# Altium project ws22_companion-1_0_0.PrjPcb (part 1 of 4)
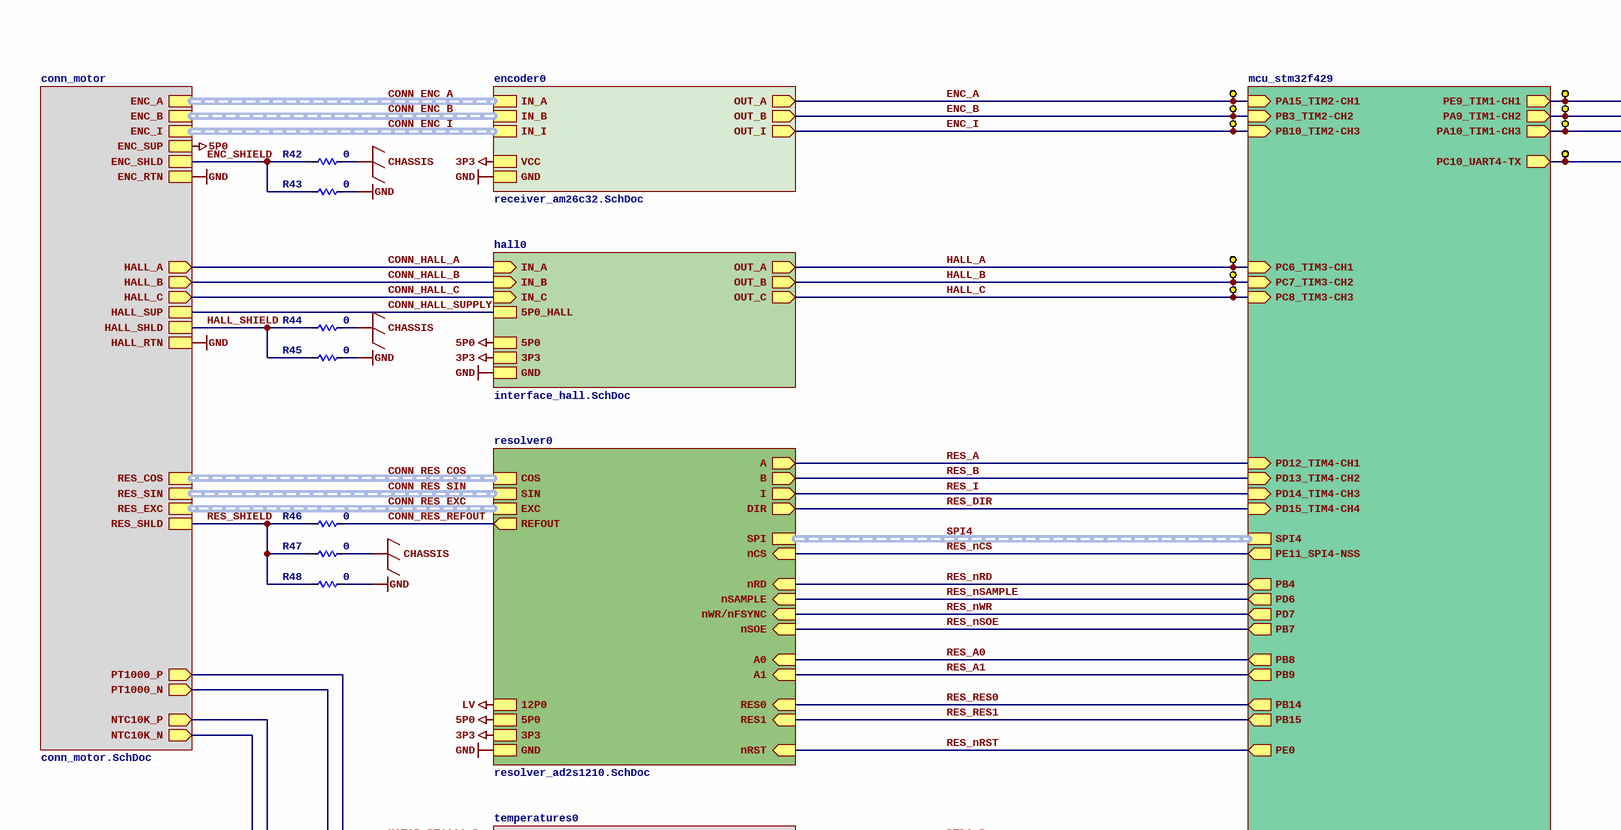
[diagram p0: top.SchDoc, top left]
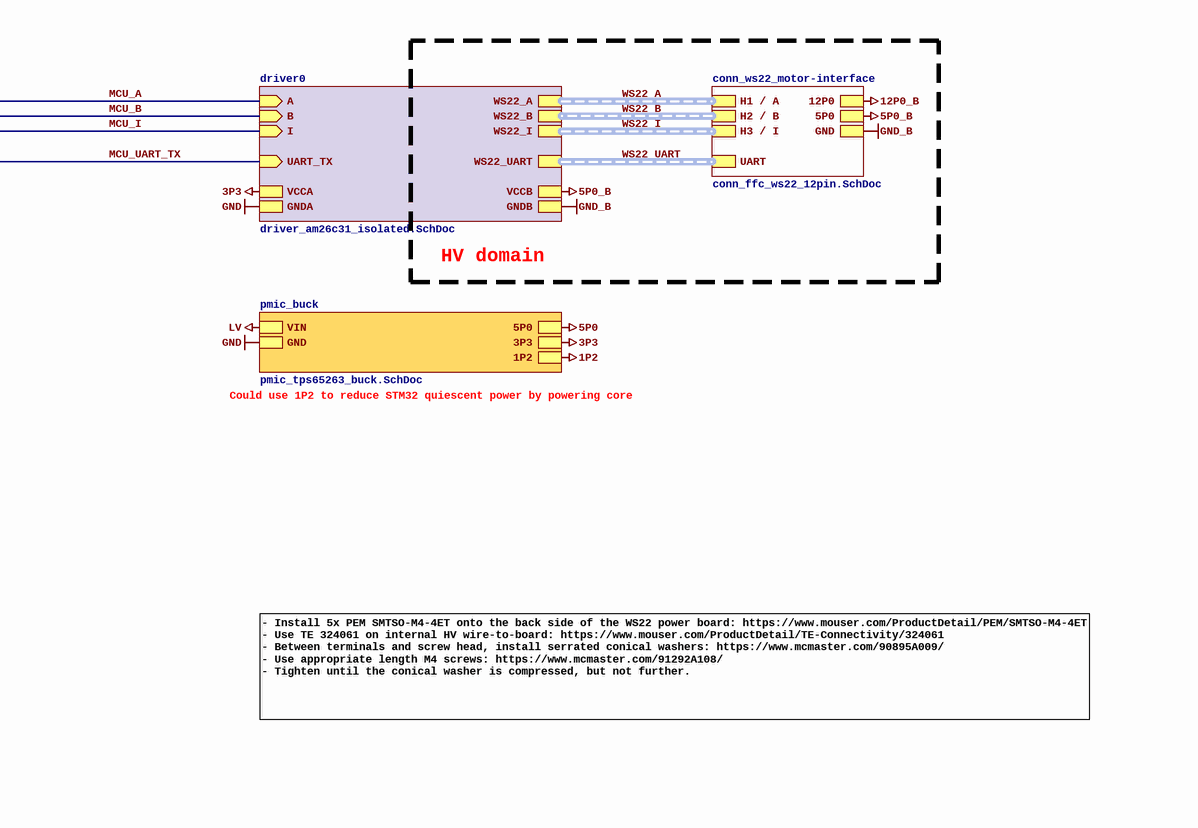
[diagram p1: top.SchDoc, top right]
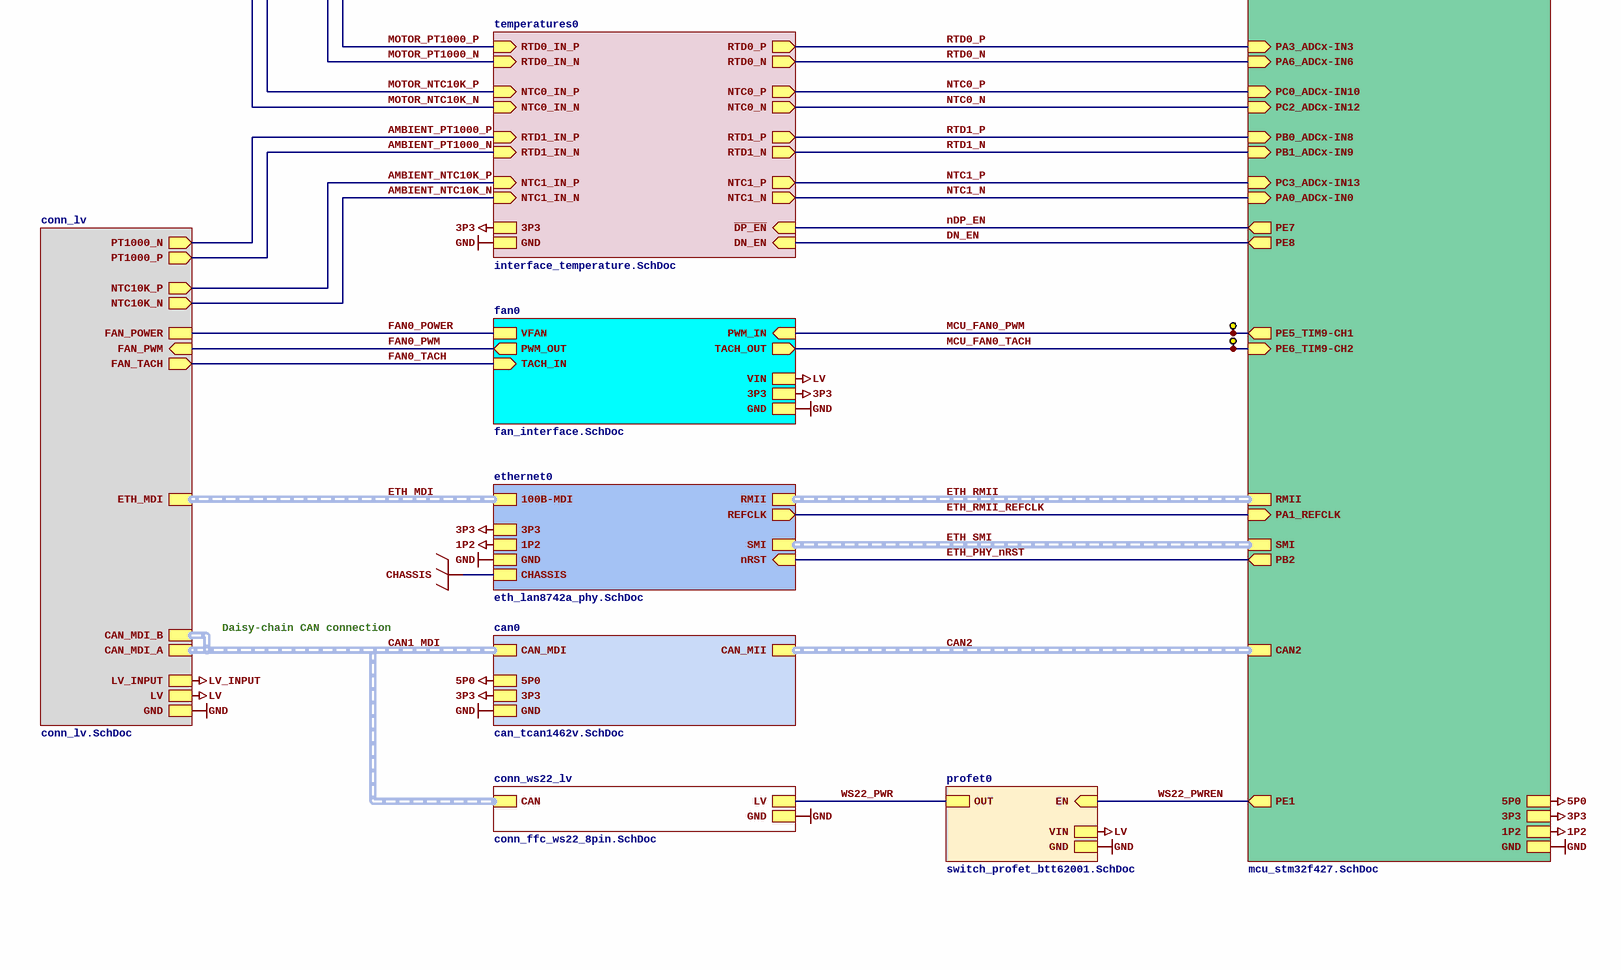
[diagram p2: top.SchDoc, bottom left]
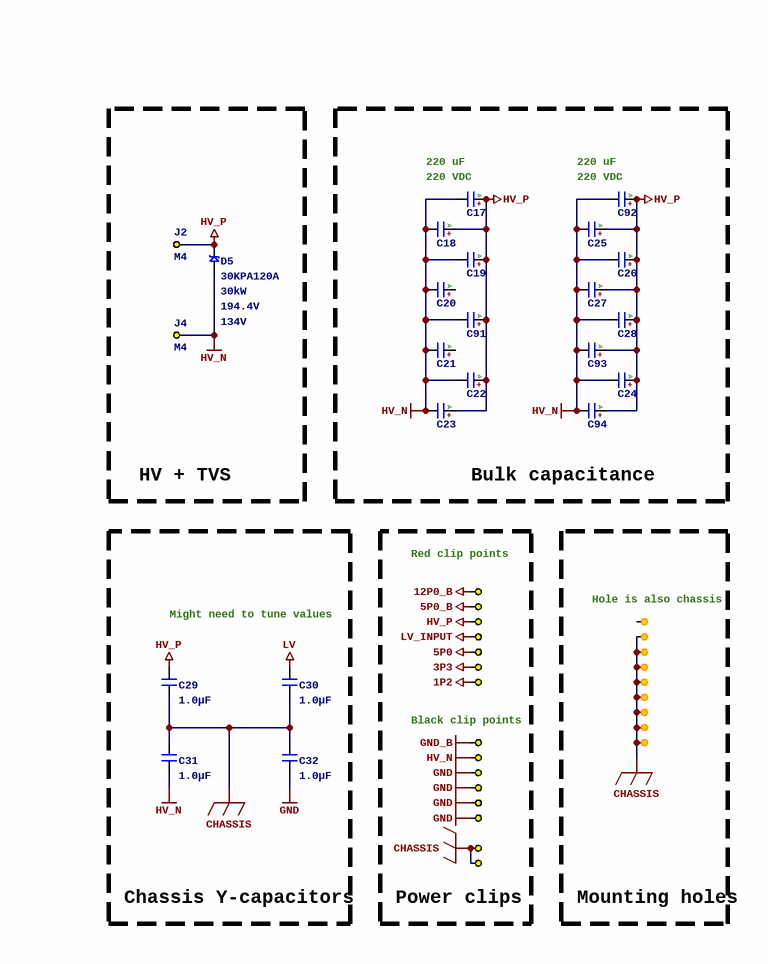
[diagram p3: top.SchDoc, bottom right]
20 sheets, 368 parts. Net scope: strictly hierarchical (ports join the sheet entries above them; power ports are local).
Board file: ws22_companion-1_0_0.PcbDoc
Sheets:
  top.SchDoc
    mcu_stm32f429 = mcu_stm32f427.SchDoc
      conn_usbc = conn_usbc.SchDoc
    pmic_buck = pmic_tps65263_buck.SchDoc
    fan0 = fan_interface.SchDoc
    can0 = can_tcan1462v.SchDoc
    ethernet0 = eth_lan8742a_phy.SchDoc
      eth_100base-tx_magnetics = eth_100base-tx_magnetics.SchDoc
    conn_ws22_lv = conn_ffc_ws22_8pin.SchDoc
    conn_ws22_motor-interface = conn_ffc_ws22_12pin.SchDoc
    conn_lv = conn_lv.SchDoc
    conn_motor = conn_motor.SchDoc
    driver0 = driver_am26c31_isolated.SchDoc
    resolver0 = resolver_ad2s1210.SchDoc
    profet0 = switch_profet_btt62001.SchDoc
    hall0 = interface_hall.SchDoc
    encoder0 = receiver_am26c32.SchDoc
    temperatures0 = interface_temperature.SchDoc
      ntc0 = interface_ntc10k.SchDoc
      rtd0 = interface_pt1000.SchDoc
      ntc1 = interface_ntc10k.SchDoc
      rtd1 = interface_pt1000.SchDoc

## Sheet top.SchDoc
size C; SheetNumber: 1

### Parts
C17  EKXJ221ELL221MM25S  [CAP_1600X2700X750]  (value not drawn)
C18  EKXJ221ELL221MM25S  [CAP_1600X2700X750]  (value not drawn)
C19  EKXJ221ELL221MM25S  [CAP_1600X2700X750]  (value not drawn)
C20  EKXJ221ELL221MM25S  [CAP_1600X2700X750]  (value not drawn)
C21  EKXJ221ELL221MM25S  [CAP_1600X2700X750]  (value not drawn)
C22  EKXJ221ELL221MM25S  [CAP_1600X2700X750]  (value not drawn)
C23  EKXJ221ELL221MM25S  [CAP_1600X2700X750]  (value not drawn)
C24  EKXJ221ELL221MM25S  [CAP_1600X2700X750]  (value not drawn)
C25  EKXJ221ELL221MM25S  [CAP_1600X2700X750]  (value not drawn)
C26  EKXJ221ELL221MM25S  [CAP_1600X2700X750]  (value not drawn)
C27  EKXJ221ELL221MM25S  [CAP_1600X2700X750]  (value not drawn)
C28  EKXJ221ELL221MM25S  [CAP_1600X2700X750]  (value not drawn)
C29  Capacitance: 1.0µF  [KNSCHA-CAP-MPB-S]  (hidden comment: MPB105J2WD4KN1580S)
C30  Capacitance: 1.0µF  [KNSCHA-CAP-MPB-S]  (hidden comment: MPB105J2WD4KN1580S)
C31  Capacitance: 1.0µF  [KNSCHA-CAP-MPB-S]  (hidden comment: MPB105J2WD4KN1580S)
C32  Capacitance: 1.0µF  [KNSCHA-CAP-MPB-S]  (hidden comment: MPB105J2WD4KN1580S)
C91  EKXJ221ELL221MM25S  [CAP_1600X2700X750]  (value not drawn)
C92  EKXJ221ELL221MM25S  [CAP_1600X2700X750]  (value not drawn)
C93  EKXJ221ELL221MM25S  [CAP_1600X2700X750]  (value not drawn)
C94  EKXJ221ELL221MM25S  [CAP_1600X2700X750]  (value not drawn)
D5  30KPA120A  Non-rep Peak Rev Power Dis-Max: 30kW  Clamping Voltage-Max: 194.4V  Min Breakdown Voltage: 134V  [P600]
J2  Thread Size: M4  [WURTH_TERM_7461086]  (hidden comment: 7461086)
J4  Thread Size: M4  [WURTH_TERM_7461086]  (hidden comment: 7461086)
MH1  HOLE_M3  [HOLE_M3]  (value not drawn)  (no BOM)
MH2  HOLE_M3  [HOLE_M3]  (value not drawn)  (no BOM)
MH3  HOLE_M3  [HOLE_M3]  (value not drawn)  (no BOM)
MH4  HOLE_M3  [HOLE_M3]  (value not drawn)  (no BOM)
MH5  HOLE_M3  [HOLE_M3]  (value not drawn)  (no BOM)
MH6  HOLE_M3  [HOLE_M3]  (value not drawn)  (no BOM)
MH7  HOLE_M3  [HOLE_M3]  (value not drawn)  (no BOM)
MH8  HOLE_M3  [HOLE_M3]  (value not drawn)  (no BOM)
MH9  HOLE_M3  [HOLE_M3]  (value not drawn)  (no BOM)
R42  Resistance: 0  [R0402_0.40MM]  (hidden comment: ERJ-2GE0R00X)
R43  Resistance: 0  [R0402_0.40MM]  (hidden comment: ERJ-2GE0R00X)
R44  Resistance: 0  [R0402_0.40MM]  (hidden comment: ERJ-2GE0R00X)
R45  Resistance: 0  [R0402_0.40MM]  (hidden comment: ERJ-2GE0R00X)
R46  Resistance: 0  [R0402_0.40MM]  (hidden comment: ERJ-2GE0R00X)
R47  Resistance: 0  [R0402_0.40MM]  (hidden comment: ERJ-2GE0R00X)
R48  Resistance: 0  [R0402_0.40MM]  (hidden comment: ERJ-2GE0R00X)
TP8  (no value)  [TP_GRABBY]  (no BOM)
TP9  (no value)  [TP_GRABBY]  (no BOM)
TP10  (no value)  [TP_GRABBY]  (no BOM)
TP11  (no value)  [TP_GRABBY]  (no BOM)
TP12  (no value)  [TP_GRABBY]  (no BOM)
TP13  (no value)  [TP_GRABBY]  (no BOM)
TP14  (no value)  [TP_GRABBY]  (no BOM)
TP15  (no value)  [TP_GRABBY]  (no BOM)
TP16  (no value)  [TP_GRABBY]  (no BOM)
TP17  (no value)  [TP_GRABBY]  (no BOM)
TP32  (no value)  [TP_GRABBY]  (no BOM)
TP33  (no value)  [TP_GRABBY]  (no BOM)
TP37  RH-5000  [TP_RH-5000]  (value not drawn)
TP38  RH-5000  [TP_RH-5000]  (value not drawn)
TP39  RH-5000  [TP_RH-5000]  (value not drawn)
TP41  RH-5000  [TP_RH-5000]  (value not drawn)
TP42  RH-5000  [TP_RH-5000]  (value not drawn)
TP43  RH-5000  [TP_RH-5000]  (value not drawn)
TP44  RH-5000  [TP_RH-5000]  (value not drawn)
TP45  RH-5001  [TP_RH-5001]  (value not drawn)
TP47  RH-5001  [TP_RH-5001]  (value not drawn)
TP48  RH-5001  [TP_RH-5001]  (value not drawn)
TP49  RH-5001  [TP_RH-5001]  (value not drawn)
TP50  RH-5001  [TP_RH-5001]  (value not drawn)
TP51  RH-5001  [TP_RH-5001]  (value not drawn)
TP52  RH-5001  [TP_RH-5001]  (value not drawn)
TP53  RH-5001  [TP_RH-5001]  (value not drawn)

### Blocks framed on the sheet
HV + TVS: D5 J2 J4
Bulk capacitance: C17-C28 C91-C94
Chassis Y-capacitors: C29-C32
Power clips: TP37-TP39 TP41-TP45 TP47-TP53
Mounting holes: MH1-MH9

### Sub-sheets
can0 = can_tcan1462v.SchDoc: GND, 5P0, CAN_MII (harness CAN), CAN_MDI (harness DIFF), 3P3
conn_lv = conn_lv.SchDoc: ETH_MDI (harness 100BASE-TX), CAN_MDI_A (harness DIFF), FAN_PWM (in), FAN_TACH (out), GND, LV, PT1000_N (out), PT1000_P (out), FAN_POWER, CAN_MDI_B (harness DIFF), NTC10K_P (out), NTC10K_N (out), LV_INPUT
conn_motor = conn_motor.SchDoc: RES_SHLD, RES_EXC (harness DIFF), RES_COS (harness DIFF), RES_SIN (harness DIFF), PT1000_P (out), PT1000_N (out), NTC10K_P (out), NTC10K_N (out), ENC_A (harness DIFF), ENC_B (harness DIFF), ENC_I (harness DIFF), ENC_SHLD, ENC_SUP, ENC_RTN, HALL_RTN, HALL_SUP, HALL_A (out), HALL_B (out), HALL_C (out), HALL_SHLD
conn_ws22_lv = conn_ffc_ws22_8pin.SchDoc: CAN (harness DIFF), GND, LV
conn_ws22_motor-interface = conn_ffc_ws22_12pin.SchDoc: H1 / A (harness DIFF), H2 / B (harness DIFF), H3 / I (harness DIFF), UART (harness DIFF), GND, 12P0, 5P0
driver0 = driver_am26c31_isolated.SchDoc: WS22_UART (harness DIFF), WS22_I (harness DIFF), WS22_B (harness DIFF), WS22_A (harness DIFF), UART_TX (in), I (in), B (in), A (in), VCCB, GNDB, VCCA, GNDA
encoder0 = receiver_am26c32.SchDoc: VCC, GND, IN_I (harness DIFF), IN_B (harness DIFF), IN_A (harness DIFF), OUT_I (out), OUT_B (out), OUT_A (out)
ethernet0 = eth_lan8742a_phy.SchDoc: 3P3, 1P2, GND, REFCLK (out), SMI (harness SMI), RMII (harness RMII), 100B-MDI (harness 100BASE-TX), nRST (in), CHASSIS
fan0 = fan_interface.SchDoc: GND, 3P3, VFAN, PWM_IN (in), TACH_IN (in), VIN, TACH_OUT (out), PWM_OUT (out)
hall0 = interface_hall.SchDoc: IN_B (in), IN_A (in), IN_C (in), OUT_B (out), OUT_A (out), OUT_C (out), 5P0, 3P3, GND, 5P0_HALL
mcu_stm32f429 = mcu_stm32f427.SchDoc: GND, 3P3, CAN2 (harness CAN), PA1_REFCLK (in), RMII (harness RMII), SMI (harness SMI), 5P0, 1P2, PA15_TIM2-CH1 (in), PE7 (out), PE8 (out), PA0_ADCx-IN0 (in), PC3_ADCx-IN13 (in), PB1_ADCx-IN9 (in), PB0_ADCx-IN8 (in), PC2_ADCx-IN12 (in), PC0_ADCx-IN10 (in), PA6_ADCx-IN6 (in), PA3_ADCx-IN3 (in), PC8_TIM3-CH3 (in), PB3_TIM2-CH2 (in), PC6_TIM3-CH1 (in), PC7_TIM3-CH2 (in), PB10_TIM2-CH3 (in), PD12_TIM4-CH1 (in), PD13_TIM4-CH2 (in), PD14_TIM4-CH3 (in), PD15_TIM4-CH4 (in), SPI4 (harness SPI), PE11_SPI4-NSS (out), PB4 (out), PD6 (out), PD7 (out), PB7 (out), PB8 (out), PB9 (out), PB14 (out), PB15 (out), PE0 (out), PE9_TIM1-CH1 (out), PA9_TIM1-CH2 (out), PA10_TIM1-CH3 (out), PC10_UART4-TX (out), PE5_TIM9-CH1 (out), PE6_TIM9-CH2 (in), PB2 (out), PE1 (out)
pmic_buck = pmic_tps65263_buck.SchDoc: VIN, 5P0, GND, 3P3, 1P2
profet0 = switch_profet_btt62001.SchDoc: EN (in), GND, OUT, VIN
resolver0 = resolver_ad2s1210.SchDoc: COS (harness DIFF), SIN (harness DIFF), REFOUT (out), EXC (harness DIFF), 12P0, 5P0, GND, RES0 (in), RES1 (in), A (out), B (out), I (out), DIR (out), nRST (in), A0 (in), A1 (in), 3P3, SPI (harness SPI), nRD (in), nCS (in), nSAMPLE (in), nWR/nFSYNC (in), nSOE (in)
temperatures0 = interface_temperature.SchDoc: NTC0_P (out), NTC0_N (out), NTC1_P (out), NTC1_N (out), RTD0_P (out), RTD0_N (out), RTD1_P (out), RTD1_N (out), 3P3, GND, DN_EN (in), ~{DP_EN} (in), NTC0_IN_P (in), NTC0_IN_N (in), NTC1_IN_P (in), NTC1_IN_N (in), RTD0_IN_P (in), RTD0_IN_N (in), RTD1_IN_P (in), RTD1_IN_N (in)

### Nets
1P2: TP44.1 ; sheet mcu_stm32f429/1P2, sheet pmic_buck/1P2, sheet ethernet0/1P2
3P3: TP43.1 ; sheet mcu_stm32f429/3P3, sheet pmic_buck/3P3, sheet fan0/3P3, sheet can0/3P3, sheet ethernet0/3P3, sheet driver0/VCCA, sheet resolver0/3P3, sheet hall0/3P3, sheet encoder0/VCC, sheet temperatures0/3P3
5P0: TP42.1 ; sheet mcu_stm32f429/5P0, sheet pmic_buck/5P0, sheet can0/5P0, sheet conn_motor/ENC_SUP, sheet resolver0/5P0, sheet hall0/5P0
5P0_B: TP38.1 ; sheet conn_ws22_motor-interface/5P0, sheet driver0/VCCB
12P0_B: TP37.1 ; sheet conn_ws22_motor-interface/12P0
CHASSIS: C29.2 C30.2 C31.1 C32.1 MH1.0 MH2.0 MH3.0 MH4.0 MH5.0 MH6.0 MH7.0 MH8.0 R42.1 R44.1 R47.1 TP52.1 TP53.1 ; sheet ethernet0/CHASSIS
GND: C32.2 R43.1 R45.1 R48.1 TP48.1 TP49.1 TP50.1 TP51.1 ; sheet mcu_stm32f429/GND, sheet pmic_buck/GND, sheet fan0/GND, sheet can0/GND, sheet ethernet0/GND, sheet conn_ws22_lv/GND, sheet conn_lv/GND, sheet conn_motor/ENC_RTN, sheet conn_motor/HALL_RTN, sheet driver0/GNDA, sheet resolver0/GND, sheet profet0/GND, sheet hall0/GND, sheet encoder0/GND, sheet temperatures0/GND
GND_B: TP45.1 ; sheet conn_ws22_motor-interface/GND, sheet driver0/GNDB
HV_N: C17.2 C18.2 C19.2 C20.2 C21.2 C22.2 C23.2 C24.2 C25.2 C26.2 C27.2 C28.2 C31.2 C91.2 C92.2 C93.2 C94.2 D5.1 J4.0 TP47.1
HV_P: C17.1 C18.1 C19.1 C22.1 C23.1 C24.1 C25.1 C26.1 C27.1 C28.1 C29.1 C91.1 C92.1 C93.1 C94.1 D5.2 J2.0 TP39.1
LV: C30.1 ; sheet pmic_buck/VIN, sheet fan0/VIN, sheet conn_lv/LV, sheet resolver0/12P0, sheet profet0/VIN
LV_INPUT: TP41.1 ; sheet conn_lv/LV_INPUT
AMBIENT_NTC10K_N: sheet conn_lv/NTC10K_N, sheet temperatures0/NTC1_IN_N
AMBIENT_NTC10K_P: sheet conn_lv/NTC10K_P, sheet temperatures0/NTC1_IN_P
AMBIENT_PT1000_N: sheet conn_lv/PT1000_P, sheet temperatures0/RTD1_IN_N
AMBIENT_PT1000_P: sheet conn_lv/PT1000_N, sheet temperatures0/RTD1_IN_P
CONN_HALL_A: sheet conn_motor/HALL_A, sheet hall0/IN_A
CONN_HALL_B: sheet conn_motor/HALL_B, sheet hall0/IN_B
CONN_HALL_C: sheet conn_motor/HALL_C, sheet hall0/IN_C
CONN_HALL_SUPPLY: sheet conn_motor/HALL_SUP, sheet hall0/5P0_HALL
CONN_RES_REFOUT: R46.1 ; sheet resolver0/REFOUT
DN_EN: sheet mcu_stm32f429/PE8, sheet temperatures0/DN_EN
ENC_A: TP8.1 ; sheet mcu_stm32f429/PA15_TIM2-CH1, sheet encoder0/OUT_A
ENC_B: TP10.1 ; sheet mcu_stm32f429/PB3_TIM2-CH2, sheet encoder0/OUT_B
ENC_I: TP12.1 ; sheet mcu_stm32f429/PB10_TIM2-CH3, sheet encoder0/OUT_I
ENC_SHIELD: R42.2 R43.2 ; sheet conn_motor/ENC_SHLD
ETH_PHY_nRST: sheet mcu_stm32f429/PB2, sheet ethernet0/nRST
ETH_RMII_REFCLK: sheet mcu_stm32f429/PA1_REFCLK, sheet ethernet0/REFCLK
FAN0_POWER: sheet fan0/VFAN, sheet conn_lv/FAN_POWER
FAN0_PWM: sheet fan0/PWM_OUT, sheet conn_lv/FAN_PWM
FAN0_TACH: sheet fan0/TACH_IN, sheet conn_lv/FAN_TACH
HALL_A: TP15.1 ; sheet mcu_stm32f429/PC6_TIM3-CH1, sheet hall0/OUT_A
HALL_B: TP16.1 ; sheet mcu_stm32f429/PC7_TIM3-CH2, sheet hall0/OUT_B
HALL_C: TP17.1 ; sheet mcu_stm32f429/PC8_TIM3-CH3, sheet hall0/OUT_C
HALL_SHIELD: R44.2 R45.2 ; sheet conn_motor/HALL_SHLD
MCU_A: TP9.1 ; sheet mcu_stm32f429/PE9_TIM1-CH1, sheet driver0/A
MCU_B: TP11.1 ; sheet mcu_stm32f429/PA9_TIM1-CH2, sheet driver0/B
MCU_FAN0_PWM: TP32.1 ; sheet mcu_stm32f429/PE5_TIM9-CH1, sheet fan0/PWM_IN
MCU_FAN0_TACH: TP33.1 ; sheet mcu_stm32f429/PE6_TIM9-CH2, sheet fan0/TACH_OUT
MCU_I: TP13.1 ; sheet mcu_stm32f429/PA10_TIM1-CH3, sheet driver0/I
MCU_UART_TX: TP14.1 ; sheet mcu_stm32f429/PC10_UART4-TX, sheet driver0/UART_TX
MOTOR_NTC10K_N: sheet conn_motor/NTC10K_N, sheet temperatures0/NTC0_IN_N
MOTOR_NTC10K_P: sheet conn_motor/NTC10K_P, sheet temperatures0/NTC0_IN_P
MOTOR_PT1000_N: sheet conn_motor/PT1000_N, sheet temperatures0/RTD0_IN_N
MOTOR_PT1000_P: sheet conn_motor/PT1000_P, sheet temperatures0/RTD0_IN_P
nDP_EN: sheet mcu_stm32f429/PE7, sheet temperatures0/~{DP_EN}
NTC0_N: sheet mcu_stm32f429/PC2_ADCx-IN12, sheet temperatures0/NTC0_N
NTC0_P: sheet mcu_stm32f429/PC0_ADCx-IN10, sheet temperatures0/NTC0_P
NTC1_N: sheet mcu_stm32f429/PA0_ADCx-IN0, sheet temperatures0/NTC1_N
NTC1_P: sheet mcu_stm32f429/PC3_ADCx-IN13, sheet temperatures0/NTC1_P
RES_A: sheet mcu_stm32f429/PD12_TIM4-CH1, sheet resolver0/A
RES_A0: sheet mcu_stm32f429/PB8, sheet resolver0/A0
RES_A1: sheet mcu_stm32f429/PB9, sheet resolver0/A1
RES_B: sheet mcu_stm32f429/PD13_TIM4-CH2, sheet resolver0/B
RES_DIR: sheet mcu_stm32f429/PD15_TIM4-CH4, sheet resolver0/DIR
RES_I: sheet mcu_stm32f429/PD14_TIM4-CH3, sheet resolver0/I
RES_nCS: sheet mcu_stm32f429/PE11_SPI4-NSS, sheet resolver0/nCS
RES_nRD: sheet mcu_stm32f429/PB4, sheet resolver0/nRD
RES_nRST: sheet mcu_stm32f429/PE0, sheet resolver0/nRST
RES_nSAMPLE: sheet mcu_stm32f429/PD6, sheet resolver0/nSAMPLE
RES_nSOE: sheet mcu_stm32f429/PB7, sheet resolver0/nSOE
RES_nWR: sheet mcu_stm32f429/PD7, sheet resolver0/nWR/nFSYNC
RES_RES0: sheet mcu_stm32f429/PB14, sheet resolver0/RES0
RES_RES1: sheet mcu_stm32f429/PB15, sheet resolver0/RES1
RES_SHIELD: R46.2 R47.2 R48.2 ; sheet conn_motor/RES_SHLD
RTD0_N: sheet mcu_stm32f429/PA6_ADCx-IN6, sheet temperatures0/RTD0_N
RTD0_P: sheet mcu_stm32f429/PA3_ADCx-IN3, sheet temperatures0/RTD0_P
RTD1_N: sheet mcu_stm32f429/PB1_ADCx-IN9, sheet temperatures0/RTD1_N
RTD1_P: sheet mcu_stm32f429/PB0_ADCx-IN8, sheet temperatures0/RTD1_P
WS22_PWR: sheet conn_ws22_lv/LV, sheet profet0/OUT
WS22_PWREN: sheet mcu_stm32f429/PE1, sheet profet0/EN

Not connected (* = marked no-connect by the designer): C20 1; C21 1; MH9 0

### Buses and harness runs
harness CAN1_MDI = sheet can0/CAN_MDI = sheet conn_lv/CAN_MDI_A = sheet conn_lv/CAN_MDI_B = sheet conn_ws22_lv/CAN
harness CAN2 = sheet can0/CAN_MII = sheet mcu_stm32f429/CAN2
harness CONN_ENC_A = sheet conn_motor/ENC_A = sheet encoder0/IN_A
harness CONN_ENC_B = sheet conn_motor/ENC_B = sheet encoder0/IN_B
harness CONN_ENC_I = sheet conn_motor/ENC_I = sheet encoder0/IN_I
harness CONN_RES_COS = sheet conn_motor/RES_COS = sheet resolver0/COS
harness CONN_RES_EXC = sheet conn_motor/RES_EXC = sheet resolver0/EXC
harness CONN_RES_SIN = sheet conn_motor/RES_SIN = sheet resolver0/SIN
harness ETH_MDI = sheet conn_lv/ETH_MDI = sheet ethernet0/100B-MDI
harness ETH_RMII = sheet ethernet0/RMII = sheet mcu_stm32f429/RMII
harness ETH_SMI = sheet ethernet0/SMI = sheet mcu_stm32f429/SMI
harness SPI4 = sheet mcu_stm32f429/SPI4 = sheet resolver0/SPI
harness WS22_A = sheet conn_ws22_motor-interface/H1 / A = sheet driver0/WS22_A
harness WS22_B = sheet conn_ws22_motor-interface/H2 / B = sheet driver0/WS22_B
harness WS22_I = sheet conn_ws22_motor-interface/H3 / I = sheet driver0/WS22_I
harness WS22_UART = sheet conn_ws22_motor-interface/UART = sheet driver0/WS22_UART

### Notes on the sheet
- HV domain
- Could use 1P2 to reduce STM32 quiescent power by powering core
- - Install 5x PEM SMTSO-M4-4ET onto the back side of the WS22 power board: https://www.mouser.com/ProductDetail/PEM/SMTSO-M4-4ET
  - Use TE 324061 on internal HV wire-to-board: https://www.mouser.com/ProductDetail/TE-Connectivity/324061
  - Between terminals and screw head, install serrated conical washers: https://www.mcmaster.com/90895A009/
  - Use appropriate length M4 screws: https://www.mcmaster.com/91292A108/
  - Tighten until the conical washer is compressed, but not further.
- (near C17) 220 uF
- (near C17) 220 VDC
- (near C92) 220 uF
- (near C92) 220 VDC
- Daisy-chain CAN connection
- Red clip points
- (near MH9) Hole is also chassis
- Might need to tune values
- (near TP45) Black clip points
- (in symbol AUTO_CAP_ALUM_220UF_220V_EKXJ221ELL221MM25S) A; +

### Library data of the parts
C17-C28 C91-C94 = AUTO_CAP_ALUM_220UF_220V_EKXJ221ELL221MM25S: Aluminum Electrolytic Capacitor, Polarized, Aluminum (wet), 220V, 20% +Tol, 20% -Tol, 220uF, Through Hole Mount; Manufacturer: United Chemi-Con; Manufacturer Part Number: EKXJ221ELL221MM25S; ComponentLink4URL: http://www.chemi-con.co.jp/cgi-bin/CAT_DB/SEARCH/cat_db_al.cgi?e=e&amp;j=p&amp;pdfname=kxj; ComponentLink4Description: Datasheet; Supplier 1: Digikey; Supplier Part Number 1: 565-EKXJ221ELL221MM25S-ND; Supplier 2: LCSC; Supplier Part Number 2: C1600234
C29-C32 = CAP_FILM_1UF_450V: CAP FILM 1UF 5% 450V RADIAL; Manufacturer: KNSCHA; Supplier 1: LCSC; Manufacturer Part Number: MPB105J2WD4KN1580S; ComponentLink1URL: https://www.lcsc.com/datasheet/lcsc_datasheet_2405161619_KNSCHA-MPB105J2WD4KN1580S_C22400108.pdf; ComponentLink1Description: Datasheet; Supplier Part Number 1: C22400108
D5 = TVS_UNI_30KPA120A: Trans Voltage Suppressor Diode, 30000W, 120V V(RWM), Unidirectional, 1 Element, Silicon; Manufacturer: Littelfuse; Supplier 1: Digikey; Supplier Part Number 1: 30KPA120A-ND; Manufacturer Part Number: 30KPA120A; ComponentLink1URL: https://mm.digikey.com/Volume0/opasdata/d220001/medias/docus/4180/30KPA_Series.pdf; ComponentLink1Description: Datasheet; Supplier 2: LCSC; Supplier Part Number 2: C1984717
J2 J4 = CONN_WURTH_7461086: POWER ELEMENT BUSH M4 12PIN; Manufacturer: Wurth Electronics; Supplier 1: Digikey; Supplier Part Number 1: 732-3207-ND; Manufacturer Part Number: 7461086
R42-R48 = ERJ-2GE0R00X: RES SMD 0 OHM JUMPER 1/10W 0402; Manufacturer: Panasonic Electronic Components; Unit Price (USD): 0.1; Power (Watts): 0.1W, 1/10W; ComponentLink1Description: Datasheet; ComponentLink1URL: http://industrial.panasonic.com/www-cgi/jvcr13pz.cgi?E+PZ+3+AOA0001+ERJ2GE0R00X+7+WW; Series: ERJ; Tolerance: Jumper; Composition: Thick Film; Features: Automotive AEC-Q200; Temperature Coefficient: -; Operating Temperature: -55°C ~ 155°C; Package / Case: 0402 (1005 Metric); Supplier Device Package: 0402; Size / Dimension: 0.039" L x 0.020" W (1.00mm x 0.50mm); Height - Seated (Max): 0.016" (0.40mm); Supplier 1: Digikey; Supplier Part Number 1: P0.0JCT-ND; Manufacturer Part Number: ERJ-2GE0R00X
TP8-TP17 TP32 TP33 = TEST_GRABBER: EMBEDDED TEST POINT FOR SALEAE TEST CLIPS
TP37-TP39 TP41-TP44 = RH-5000: THT red clip turret; Manufacturer: ronghe; ComponentLink1Description: Datasheet; ComponentLink1URL: https://datasheet.lcsc.com/lcsc/2307040929_ronghe-RH-5000_C5277086.pdf; Supplier 1: LCSC; Supplier Part Number 1: C5277086; Manufacturer Part Number: RH-5000
TP45 TP47-TP53 = RH-5001: THT black clip turret; Manufacturer: ronghe; ComponentLink1Description: Datasheet; ComponentLink1URL: https://datasheet.lcsc.com/lcsc/2307040929_ronghe-RH-5000_C5277086.pdf; Supplier 1: LCSC; Supplier Part Number 1: C5199801; Manufacturer Part Number: RH-5001

## Sheet mcu_stm32f427.SchDoc
size C; SheetNumber: 2
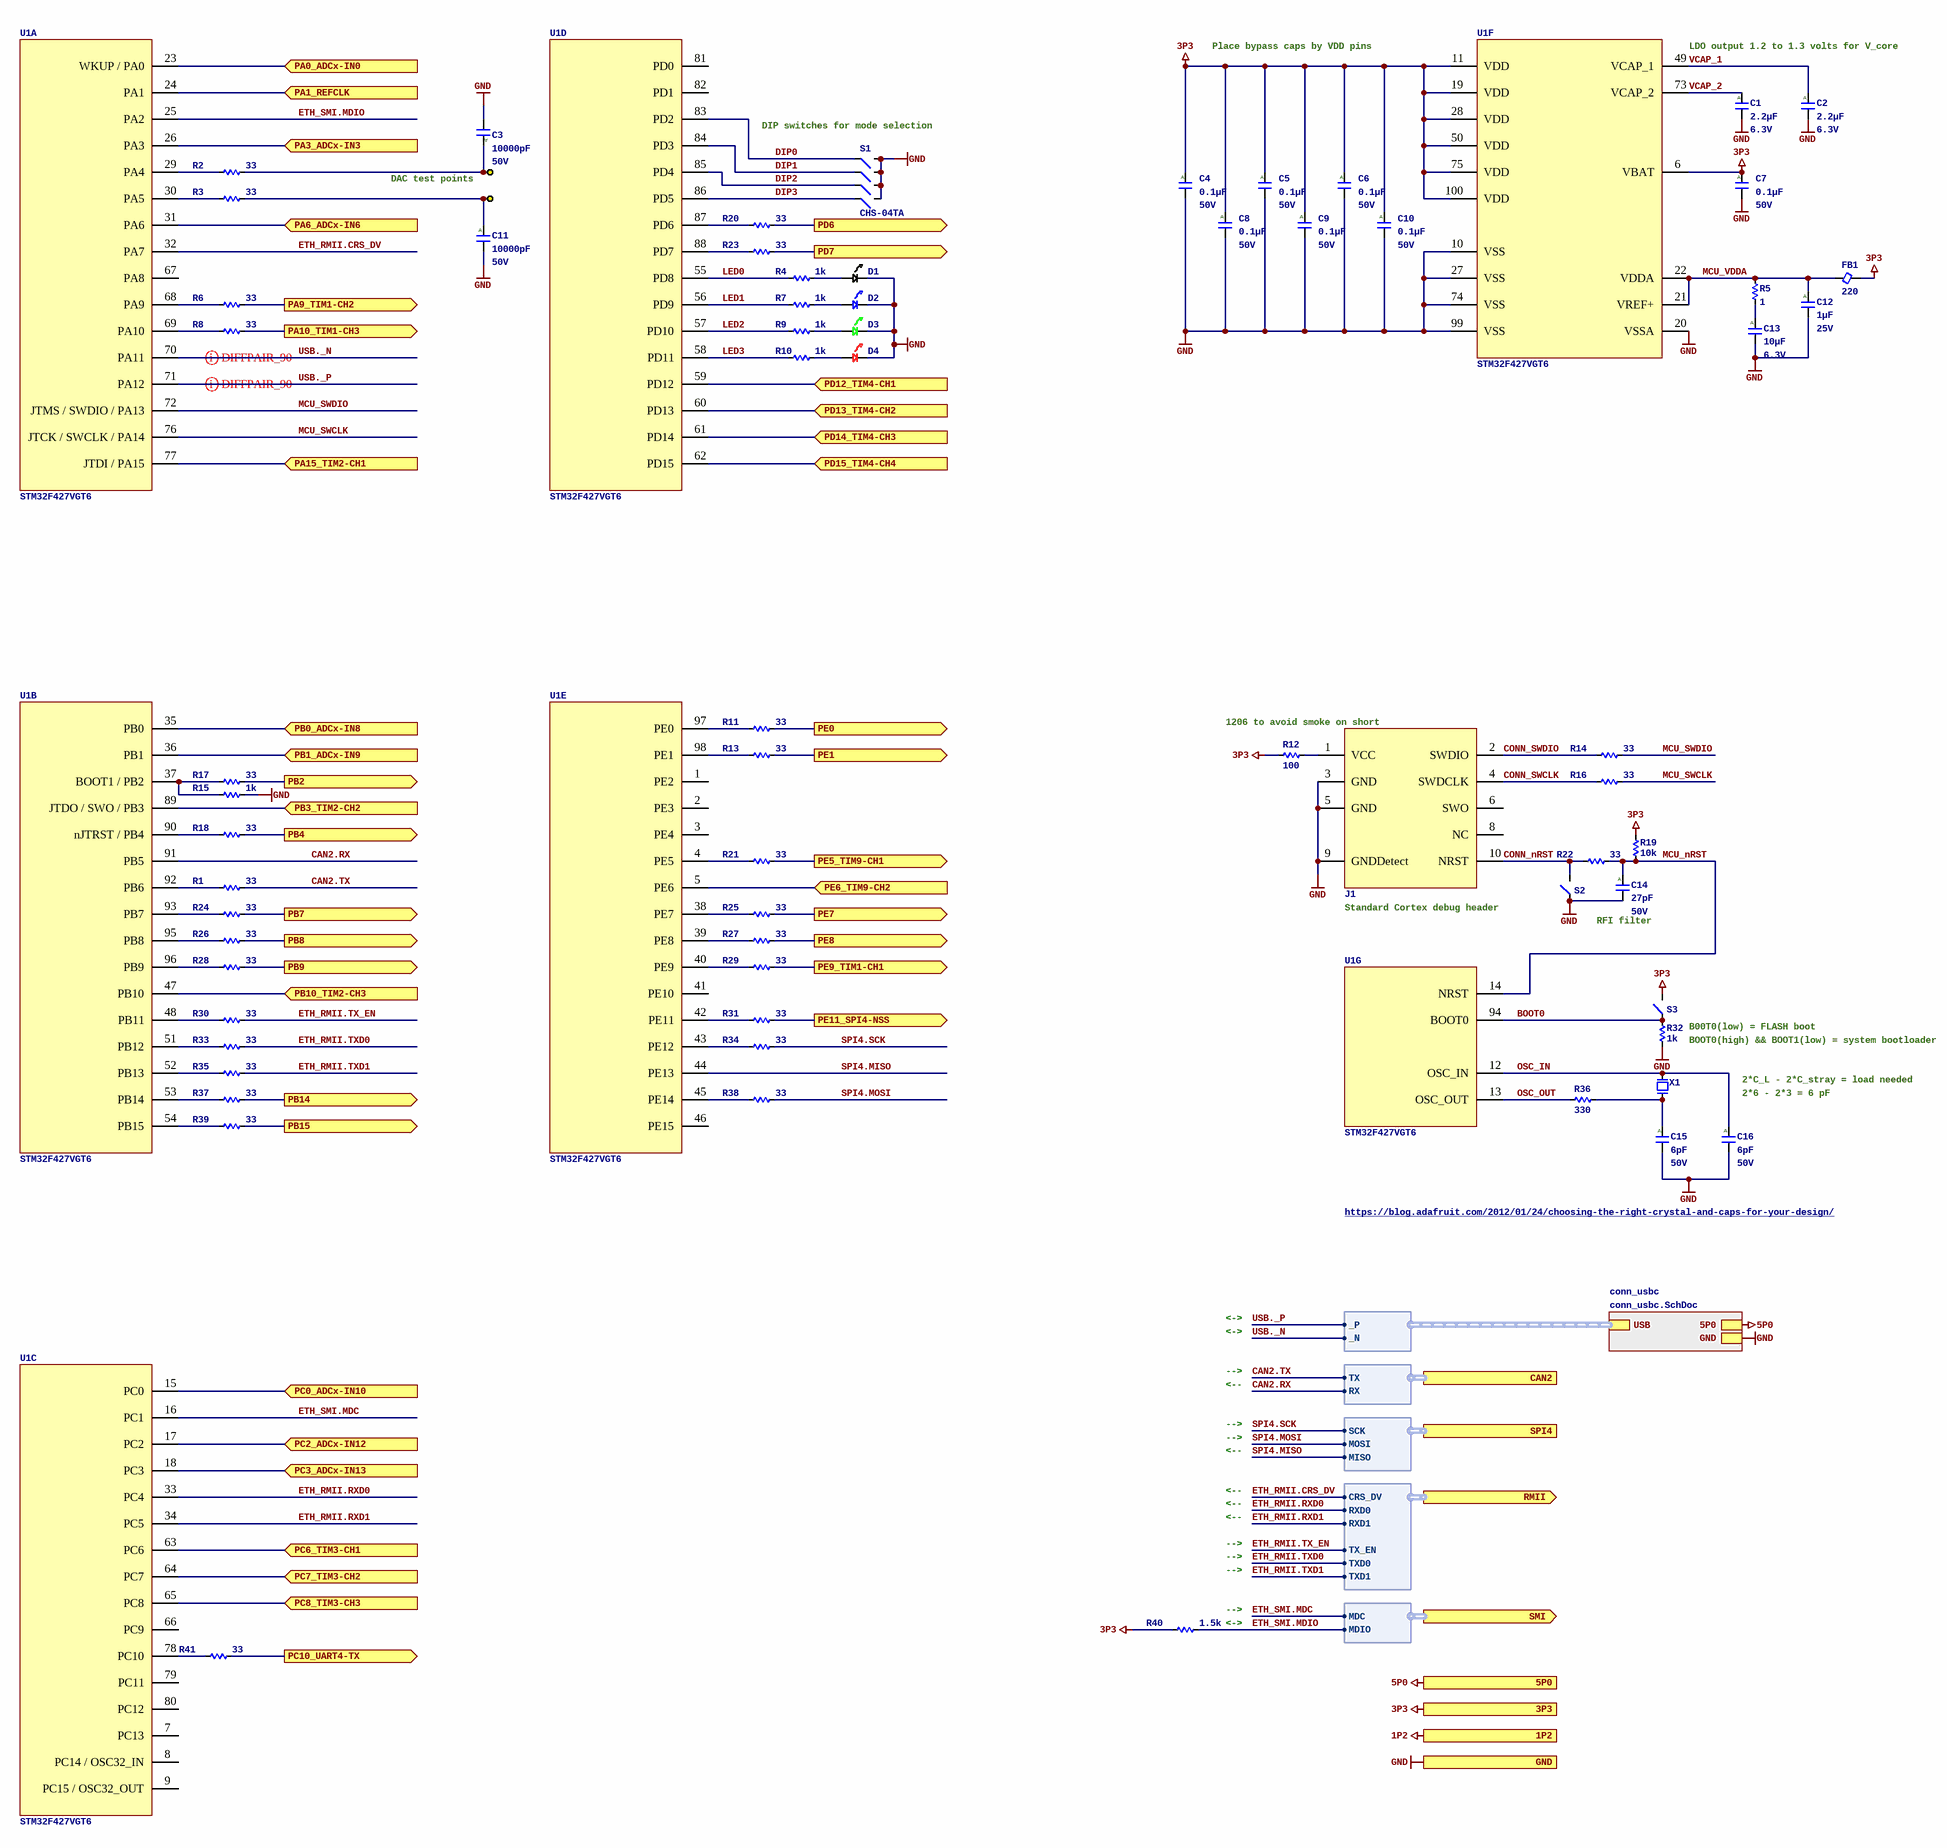
[diagram p4: mcu_stm32f427.SchDoc]

### Parts
C1  Capacitance: 2.2µF  Voltage - Rated: 6.3V  [C0603_0.90MM]  (hidden comment: CGA3E1X7R0J225M080AC)
C2  Capacitance: 2.2µF  Voltage - Rated: 6.3V  [C0603_0.90MM]  (hidden comment: CGA3E1X7R0J225M080AC)
C3  Capacitance: 10000pF  Voltage - Rated: 50V  [C0402_0.50MM]  (hidden comment: CGJ2B3X7R1H103K050BB)
C4  Capacitance: 0.1µF  Voltage - Rated: 50V  [C0402_0.55MM]  (hidden comment: CGA2B3X7R1H104M050BB)
C5  Capacitance: 0.1µF  Voltage - Rated: 50V  [C0402_0.55MM]  (hidden comment: CGA2B3X7R1H104M050BB)
C6  Capacitance: 0.1µF  Voltage - Rated: 50V  [C0402_0.55MM]  (hidden comment: CGA2B3X7R1H104M050BB)
C7  Capacitance: 0.1µF  Voltage - Rated: 50V  [C0402_0.55MM]  (hidden comment: CGA2B3X7R1H104M050BB)
C8  Capacitance: 0.1µF  Voltage - Rated: 50V  [C0402_0.55MM]  (hidden comment: CGA2B3X7R1H104M050BB)
C9  Capacitance: 0.1µF  Voltage - Rated: 50V  [C0402_0.55MM]  (hidden comment: CGA2B3X7R1H104M050BB)
C10  Capacitance: 0.1µF  Voltage - Rated: 50V  [C0402_0.55MM]  (hidden comment: CGA2B3X7R1H104M050BB)
C11  Capacitance: 10000pF  Voltage - Rated: 50V  [C0402_0.50MM]  (hidden comment: CGJ2B3X7R1H103K050BB)
C12  Capacitance: 1µF  Voltage - Rated: 25V  [C0603_0.80MM]  (hidden comment: CGJ3E1X7R1E105K080AC)
C13  Capacitance: 10µF  Voltage - Rated: 6.3V  [C0805_1.45MM]  (hidden comment: CGA4J1X7R0J106M125AC)
C14  Capacitance: 27pF  Voltage - Rated: 50V  [C0402_0.55MM]  (hidden comment: CGA2B2C0G1H270J050BA)
C15  Capacitance: 6pF  Voltage - Rated: 50V  [C0402_0.55MM]  (hidden comment: CGA2B2C0G1H060D050BA)
C16  Capacitance: 6pF  Voltage - Rated: 50V  [C0402_0.55MM]  (hidden comment: CGA2B2C0G1H060D050BA)
D1  LTW-C193TS5  [LED_0603P_WHITE]  (value not drawn)
D2  LTST-C191TBKT  [LED_0603P_BLUE]  (value not drawn)
D3  LTST-C190GKT  [LED_0603P_GREEN]  (value not drawn)
D4  LTST-C190KRKT  [LED_0603P_RED]  (value not drawn)
FB1  Impedance (Ohms @ 100MHz): 220  [FB0402_0.55MM]  (hidden comment: MPZ1005S221ET000)
J1  FTSH-105-01-L-DV-K  [FTSH-105-01-L-DV-K_KEYED]  (value not drawn)
R1  Resistance: 33  [R0402_0.40MM]  (hidden comment: ERJ-2RKF33R0X)
R2  Resistance: 33  [R0402_0.40MM]  (hidden comment: ERJ-2RKF33R0X)
R3  Resistance: 33  [R0402_0.40MM]  (hidden comment: ERJ-2RKF33R0X)
R4  Resistance: 1k  [R0402_0.40MM]
R5  Resistance: 1  [R0402_0.40MM]  (hidden comment: ERJ-2BQF1R0X)
R6  Resistance: 33  [R0402_0.40MM]  (hidden comment: ERJ-2RKF33R0X)
R7  Resistance: 1k  [R0402_0.40MM]
R8  Resistance: 33  [R0402_0.40MM]  (hidden comment: ERJ-2RKF33R0X)
R9  Resistance: 1k  [R0402_0.40MM]
R10  Resistance: 1k  [R0402_0.40MM]
R11  Resistance: 33  [R0402_0.40MM]  (hidden comment: ERJ-2RKF33R0X)
R12  Resistance: 100  [R1206_0.70MM]  (hidden comment: ERJ-8ENF1000V)
R13  Resistance: 33  [R0402_0.40MM]  (hidden comment: ERJ-2RKF33R0X)
R14  Resistance: 33  [R0402_0.40MM]  (hidden comment: ERJ-2RKF33R0X)
R15  Resistance: 1k  [R0402_0.40MM]
R16  Resistance: 33  [R0402_0.40MM]  (hidden comment: ERJ-2RKF33R0X)
R17  Resistance: 33  [R0402_0.40MM]  (hidden comment: ERJ-2RKF33R0X)
R18  Resistance: 33  [R0402_0.40MM]  (hidden comment: ERJ-2RKF33R0X)
R19  Resistance: 10k  [R0402_0.40MM]
R20  Resistance: 33  [R0402_0.40MM]  (hidden comment: ERJ-2RKF33R0X)
R21  Resistance: 33  [R0402_0.40MM]  (hidden comment: ERJ-2RKF33R0X)
R22  Resistance: 33  [R0402_0.40MM]  (hidden comment: ERJ-2RKF33R0X)
R23  Resistance: 33  [R0402_0.40MM]  (hidden comment: ERJ-2RKF33R0X)
R24  Resistance: 33  [R0402_0.40MM]  (hidden comment: ERJ-2RKF33R0X)
R25  Resistance: 33  [R0402_0.40MM]  (hidden comment: ERJ-2RKF33R0X)
R26  Resistance: 33  [R0402_0.40MM]  (hidden comment: ERJ-2RKF33R0X)
R27  Resistance: 33  [R0402_0.40MM]  (hidden comment: ERJ-2RKF33R0X)
R28  Resistance: 33  [R0402_0.40MM]  (hidden comment: ERJ-2RKF33R0X)
R29  Resistance: 33  [R0402_0.40MM]  (hidden comment: ERJ-2RKF33R0X)
R30  Resistance: 33  [R0402_0.40MM]  (hidden comment: ERJ-2RKF33R0X)
R31  Resistance: 33  [R0402_0.40MM]  (hidden comment: ERJ-2RKF33R0X)
R32  Resistance: 1k  [R0402_0.40MM]
R33  Resistance: 33  [R0402_0.40MM]  (hidden comment: ERJ-2RKF33R0X)
R34  Resistance: 33  [R0402_0.40MM]  (hidden comment: ERJ-2RKF33R0X)
R35  Resistance: 33  [R0402_0.40MM]  (hidden comment: ERJ-2RKF33R0X)
R36  Resistance: 330  [R0402_0.40MM]  (hidden comment: ERJ-PA2F3300X)
R37  Resistance: 33  [R0402_0.40MM]  (hidden comment: ERJ-2RKF33R0X)
R38  Resistance: 33  [R0402_0.40MM]  (hidden comment: ERJ-2RKF33R0X)
R39  Resistance: 33  [R0402_0.40MM]  (hidden comment: ERJ-2RKF33R0X)
R40  Resistance: 1.5k  [R0402_0.40MM]  (hidden comment: ERJ-2RKF1501X)
R41  Resistance: 33  [R0402_0.40MM]  (hidden comment: ERJ-2RKF33R0X)
S1  CHS-04TA  [SWITCH_NIDEC_CHS-04TA]
S2  TS-1092S-B3D2-G  [SWITCH_TS-1092S-B3D2-G]  (value not drawn)
S3  TS-1092S-B3D2-G  [SWITCH_TS-1092S-B3D2-G]  (value not drawn)
TP1  RH-5002  [TP_RH-5002]  (value not drawn)
TP2  RH-5002  [TP_RH-5002]  (value not drawn)
U1  STM32F427VGT6  [100TQFP14]  (parts A,B,C,D,E,F,G of 7)
X1  XTAL_XRCGB25M000F3A00R0  [4_SMD_2.0X1.6MM]  (value not drawn)

### Sub-sheets
conn_usbc = conn_usbc.SchDoc: 5P0, USB (harness DIFF), GND

### Ports
1P2, 3P3, 5P0, CAN2 (harness CAN), GND, PA0_ADCx-IN0 (in), PA1_REFCLK (in), PA3_ADCx-IN3 (in), PA6_ADCx-IN6 (in), PA9_TIM1-CH2 (out), PA10_TIM1-CH3 (out), PA15_TIM2-CH1 (in), PB0_ADCx-IN8 (in), PB1_ADCx-IN9 (in), PB2 (out), PB3_TIM2-CH2 (in), PB4 (out), PB7 (out), PB8 (out), PB9 (out), PB10_TIM2-CH3 (in), PB14 (out), PB15 (out), PC0_ADCx-IN10 (in), PC2_ADCx-IN12 (in), PC3_ADCx-IN13 (in), PC6_TIM3-CH1 (in), PC7_TIM3-CH2 (in), PC8_TIM3-CH3 (in), PC10_UART4-TX (out), PD6 (out), PD7 (out), PD12_TIM4-CH1 (in), PD13_TIM4-CH2 (in), PD14_TIM4-CH3 (in), PD15_TIM4-CH4 (in), PE0 (out), PE1 (out), PE5_TIM9-CH1 (out), PE6_TIM9-CH2 (in), PE7 (out), PE8 (out), PE9_TIM1-CH1 (out), PE11_SPI4-NSS (out), RMII (out, harness RMII), SMI (out, harness SMI), SPI4 (harness SPI)

### Harnesses
CAN: TX, RX
RMII: CRS_DV, RXD0, RXD1, TX_EN, TXD0, TXD1
SMI: MDC, MDIO
DIFF: _P, _N
SPI: MISO, MOSI, SCK

### Nets
3P3: C4.1 C5.1 C6.1 C7.1 C8.1 C9.1 C10.1 FB1.2 R12.2 R19.1 R40.2 S3.2 U1.6(VBAT) U1.11(VDD) U1.19(VDD) U1.28(VDD) U1.50(VDD) U1.75(VDD) U1.100(VDD) ; port 3P3
5P0: port 5P0, sheet conn_usbc/5P0
GND: C1.2 C2.2 C3.2 C4.2 C5.2 C6.2 C7.2 C8.2 C9.2 C10.2 C11.2 C12.2 C13.2 C14.2 C15.2 C16.2 D1.1 D2.1 D3.1 D4.1 J1.3(GND) J1.5(GND) J1.9(GNDDetect) R15.1 R32.2 S1.2 S1.4 S1.6 S1.8 S2.1 U1.10(VSS) U1.20(VSSA) U1.27(VSS) U1.74(VSS) U1.99(VSS) ; port GND, sheet conn_usbc/GND
BOOT0: R32.1 S3.1 U1.94(BOOT0)
CAN2.RX: U1.91(PB5) ; port CAN2.RX
CAN2.TX: R1.1 ; port CAN2.TX
CONN_nRST: J1.10(NRST) R22.2 S2.2
CONN_SWCLK: J1.4(SWDCLK) R16.2
CONN_SWDIO: J1.2(SWDIO) R14.2
DIP0: S1.7 U1.83(PD2)
DIP1: S1.5 U1.84(PD3)
DIP2: S1.3 U1.85(PD4)
DIP3: S1.1 U1.86(PD5)
DN_EN: R27.1 ; port PE8
ENC_A: U1.77(JTDI_/_PA15) ; port PA15_TIM2-CH1
ENC_B: U1.89(JTDO_/_SWO_/_PB3) ; port PB3_TIM2-CH2
ENC_I: U1.47(PB10) ; port PB10_TIM2-CH3
ETH_PHY_nRST: R17.1 ; port PB2
ETH_RMII.CRS_DV: U1.32(PA7) ; port RMII.CRS_DV
ETH_RMII.RXD0: U1.33(PC4) ; port RMII.RXD0
ETH_RMII.RXD1: U1.34(PC5) ; port RMII.RXD1
ETH_RMII.TX_EN: R30.1 ; port RMII.TX_EN
ETH_RMII.TXD0: R33.1 ; port RMII.TXD0
ETH_RMII.TXD1: R35.1 ; port RMII.TXD1
ETH_RMII_REFCLK: U1.24(PA1) ; port PA1_REFCLK
ETH_SMI.MDC: U1.16(PC1) ; port SMI.MDC
ETH_SMI.MDIO: R40.1 U1.25(PA2) ; port SMI.MDIO
HALL_A: U1.63(PC6) ; port PC6_TIM3-CH1
HALL_B: U1.64(PC7) ; port PC7_TIM3-CH2
HALL_C: U1.65(PC8) ; port PC8_TIM3-CH3
LED0: R4.2 U1.55(PD8)
LED1: R7.2 U1.56(PD9)
LED2: R9.2 U1.57(PD10)
LED3: R10.2 U1.58(PD11)
MCU_A: R29.1 ; port PE9_TIM1-CH1
MCU_B: R6.1 ; port PA9_TIM1-CH2
MCU_FAN0_PWM: R21.1 ; port PE5_TIM9-CH1
MCU_FAN0_TACH: U1.5(PE6) ; port PE6_TIM9-CH2
MCU_I: R8.1 ; port PA10_TIM1-CH3
MCU_nRST: C14.1 R19.2 R22.1 U1.14(NRST)
MCU_SWCLK: R16.1 U1.76(JTCK_/_SWCLK_/_PA14)
MCU_SWDIO: R14.1 U1.72(JTMS_/_SWDIO_/_PA13)
MCU_UART_TX: R41.1 ; port PC10_UART4-TX
MCU_VDDA: C12.1 FB1.1 R5.2 U1.21(VREF+) U1.22(VDDA)
nDP_EN: R25.1 ; port PE7
NTC0_N: U1.17(PC2) ; port PC2_ADCx-IN12
NTC0_P: U1.15(PC0) ; port PC0_ADCx-IN10
NTC1_N: U1.23(WKUP_/_PA0) ; port PA0_ADCx-IN0
NTC1_P: U1.18(PC3) ; port PC3_ADCx-IN13
OSC_IN: C16.1 U1.12(OSC_IN) X1.3
OSC_OUT: R36.1 U1.13(OSC_OUT)
RES_A: U1.59(PD12) ; port PD12_TIM4-CH1
RES_A0: R26.1 ; port PB8
RES_A1: R28.1 ; port PB9
RES_B: U1.60(PD13) ; port PD13_TIM4-CH2
RES_DIR: U1.62(PD15) ; port PD15_TIM4-CH4
RES_I: U1.61(PD14) ; port PD14_TIM4-CH3
RES_nCS: R31.1 ; port PE11_SPI4-NSS
RES_nRD: R18.1 ; port PB4
RES_nRST: R11.1 ; port PE0
RES_nSAMPLE: R20.1 ; port PD6
RES_nSOE: R24.1 ; port PB7
RES_nWR: R23.1 ; port PD7
RES_RES0: R37.1 ; port PB14
RES_RES1: R39.1 ; port PB15
RTD0_N: U1.31(PA6) ; port PA6_ADCx-IN6
RTD0_P: U1.26(PA3) ; port PA3_ADCx-IN3
RTD1_N: U1.36(PB1) ; port PB1_ADCx-IN9
RTD1_P: U1.35(PB0) ; port PB0_ADCx-IN8
SPI4.MISO: U1.44(PE13) ; port SPI4.MISO
SPI4.MOSI: R38.1 ; port SPI4.MOSI
SPI4.SCK: R34.1 ; port SPI4.SCK
USB._N: U1.70(PA11) ; sheet conn_usbc/USB._N
USB._P: U1.71(PA12) ; sheet conn_usbc/USB._P
VCAP_1: C2.1 U1.49(VCAP_1)
VCAP_2: C1.1 U1.73(VCAP_2)
WS22_PWREN: R13.1 ; port PE1
NetC3_1: C3.1 R2.1 TP1.1
NetC11_1: C11.1 R3.1 TP2.1
NetC13_1: C13.1 R5.1
NetC15_1: C15.1 R36.2 X1.1
NetD1_2: D1.2 R4.1
NetD2_2: D2.2 R7.1
NetD3_2: D3.2 R9.1
NetD4_2: D4.2 R10.1
NetJ1_1: J1.1(VCC) R12.1
NetR1_2: R1.2 U1.92(PB6)
NetR2_2: R2.2 U1.29(PA4)
NetR3_2: R3.2 U1.30(PA5)
NetR6_2: R6.2 U1.68(PA9)
NetR8_2: R8.2 U1.69(PA10)
NetR11_2: R11.2 U1.97(PE0)
NetR13_2: R13.2 U1.98(PE1)
NetR15_2: R15.2 R17.2 U1.37(BOOT1_/_PB2)
NetR18_2: R18.2 U1.90(nJTRST_/_PB4)
NetR20_2: R20.2 U1.87(PD6)
NetR21_2: R21.2 U1.4(PE5)
NetR23_2: R23.2 U1.88(PD7)
NetR24_2: R24.2 U1.93(PB7)
NetR25_2: R25.2 U1.38(PE7)
NetR26_2: R26.2 U1.95(PB8)
NetR27_2: R27.2 U1.39(PE8)
NetR28_2: R28.2 U1.96(PB9)
NetR29_2: R29.2 U1.40(PE9)
NetR30_2: R30.2 U1.48(PB11)
NetR31_2: R31.2 U1.42(PE11)
NetR33_2: R33.2 U1.51(PB12)
NetR34_2: R34.2 U1.43(PE12)
NetR35_2: R35.2 U1.52(PB13)
NetR37_2: R37.2 U1.53(PB14)
NetR38_2: R38.2 U1.45(PE14)
NetR39_2: R39.2 U1.54(PB15)
NetR41_2: R41.2 U1.78(PC10)

Not connected (* = marked no-connect by the designer): J1 6(SWO) 8(NC); U1 1(PE2) 2(PE3) 3(PE4) 7(PC13) 8(PC14_/_OSC32_IN) 9(PC15_/_OSC32_OUT) 41(PE10) 46(PE15) 66(PC9) 67(PA8) 79(PC11) 80(PC12) 81(PD0) 82(PD1)

### Layout directives
differential pair; differential pair class DE_90: USB._N, USB._P

### Notes on the sheet
- Place bypass caps by VDD pins
- (near U1) LDO output 1.2 to 1.3 volts for V_core
- (near S1) DIP switches for mode selection
- DAC test points
- 1206 to avoid smoke on short
- (near J1) Standard Cortex debug header
- RFI filter
- B00T0(low) = FLASH boot
- BOOT0(high) && BOOT1(low) = system bootloader
- 2*C_L - 2*C_stray = load needed
- (near C16) 2*6 - 2*3 = 6 pF
- https://blog.adafruit.com/2012/01/24/choosing-the-right-crystal-and-caps-for-your-design/
- <->
- -->
- <--
- (near R40) <->
- (near R40) -->
- (in symbol CGA2B2C0G1H060D050BA) A
- (in symbol CGA2B2C0G1H270J050BA) A
- (in symbol CGA2B3X7R1H104M050BB) A
- (in symbol CGA3E1X7R0J225M080AC) A
- (in symbol CGA4J1X7R0J106M125AC) A
- (in symbol CGJ2B3X7R1H103K050BB) A
- (in symbol CGJ3E1X7R1E105K080AC) A

### Library data of the parts
C1 C2 = CGA3E1X7R0J225M080AC: CAP CER 2.2UF 6.3V X7R 0603; Manufacturer: TDK Corporation; Unit Price (USD): 0.27; Tolerance: ±20%; ComponentLink1URL: https://product.tdk.com/info/en/catalog/datasheets/mlcc_automotive_general_en.pdf?ref_disty=digikey; ComponentLink1Description: Series Datasheet; Series: CGA; Part Status: Active; Temperature Coefficient: X7R; Operating Temperature: -55°C ~ 125°C; Applications: AEC-Q200; Mounting Type: Surface Mount, MLCC; Package / Case: 0603 (1608 Metric); Size / Dimension: 0.063" L x 0.031" W (1.60mm x 0.80mm); Thickness (Max): 0.035" (0.90mm); Supplier 1: Digikey; Supplier Part Number 1: 445-12572-1-ND; Manufacturer Part Number: CGA3E1X7R0J225M080AC
C3 C11 = CGJ2B3X7R1H103K050BB: CAP CER 10000PF 50V X7R 0402; Manufacturer: TDK Corporation; Unit Price (USD): 0.21; Tolerance: ±10%; ComponentLink1URL: https://product.tdk.com/info/en/catalog/datasheets/mlcc_highreliability_general_en.pdf?ref_disty=digikey; ComponentLink1Description: Series Datasheet; Series: CGJ; Part Status: Active; Temperature Coefficient: X7R; Operating Temperature: -55°C ~ 125°C; Applications: AEC-Q200; Mounting Type: Surface Mount, MLCC; Package / Case: 0402 (1005 Metric); Size / Dimension: 0.039" L x 0.020" W (1.00mm x 0.50mm); Thickness (Max): 0.020" (0.50mm); Supplier 1: Digikey; Supplier Part Number 1: 445-13304-1-ND; Manufacturer Part Number: CGJ2B3X7R1H103K050BB
C4-C10 = CGA2B3X7R1H104M050BB: CAP CER 0.1UF 50V X7R 0402; Manufacturer: TDK Corporation; Unit Price (USD): 0.17; Tolerance: ±20%; ComponentLink1URL: https://product.tdk.com/info/en/catalog/datasheets/mlcc_automotive_general_en.pdf?ref_disty=digikey; ComponentLink1Description: Series Datasheet; Series: CGA; Part Status: Active; Temperature Coefficient: X7R; Operating Temperature: -55°C ~ 125°C; Applications: AEC-Q200; Mounting Type: Surface Mount, MLCC; Package / Case: 0402 (1005 Metric); Size / Dimension: 0.039" L x 0.020" W (1.00mm x 0.50mm); Thickness (Max): 0.022" (0.55mm); Supplier 1: Digikey; Supplier Part Number 1: 445-12271-1-ND; Manufacturer Part Number: CGA2B3X7R1H104M050BB
C12 = CGJ3E1X7R1E105K080AC: CAP CER 1UF 25V X7R 0603; Manufacturer: TDK Corporation; Unit Price (USD): 0.55; Tolerance: ±10%; ComponentLink1URL: https://product.tdk.com/info/en/catalog/datasheets/mlcc_highreliability_general_en.pdf?ref_disty=digikey; ComponentLink1Description: Series Datasheet; Series: CGJ; Part Status: Active; Temperature Coefficient: X7R; Operating Temperature: -55°C ~ 125°C; Applications: AEC-Q200; Mounting Type: Surface Mount, MLCC; Package / Case: 0603 (1608 Metric); Size / Dimension: 0.063" L x 0.031" W (1.60mm x 0.80mm); Thickness (Max): 0.031" (0.80mm); Supplier 1: Digikey; Supplier Part Number 1: 445-13311-1-ND; Manufacturer Part Number: CGJ3E1X7R1E105K080AC
C13 = CGA4J1X7R0J106M125AC: CAP CER 10UF 6.3V X7R 0805; Manufacturer: TDK Corporation; Unit Price (USD): 0.43; Tolerance: ±20%; ComponentLink1URL: https://product.tdk.com/info/en/catalog/datasheets/mlcc_automotive_general_en.pdf?ref_disty=digikey; ComponentLink1Description: Series Datasheet; Series: CGA; Part Status: Active; Temperature Coefficient: X7R; Operating Temperature: -55°C ~ 125°C; Applications: AEC-Q200; Mounting Type: Surface Mount, MLCC; Package / Case: 0805 (2012 Metric); Size / Dimension: 0.079" L x 0.049" W (2.00mm x 1.25mm); Thickness (Max): 0.057" (1.45mm); Supplier 1: Digikey; Supplier Part Number 1: 445-12776-1-ND; Manufacturer Part Number: CGA4J1X7R0J106M125AC
C14 = CGA2B2C0G1H270J050BA: CAP CER 27PF 50V C0G 0402; Manufacturer: TDK Corporation; Unit Price (USD): 0.1; Tolerance: ±5%; Temperature Coefficient: C0G, NP0; ComponentLink1URL: https://product.tdk.com/info/en/catalog/datasheets/mlcc_automotive_general_en.pdf?ref_disty=digikey; ComponentLink1Description: Series Datasheet; Supplier 1: Digikey; Supplier Part Number 1: 445-5589-1-ND; Series: CGA; Part Status: Active; Operating Temperature: -55°C ~ 125°C; Applications: AEC-Q200; Mounting Type: Surface Mount, MLCC; Package / Case: 0402 (1005 Metric); Size / Dimension: 0.039" L x 0.020" W (1.00mm x 0.50mm); Thickness (Max): 0.022" (0.55mm); Manufacturer Part Number: CGA2B2C0G1H270J050BA
C15 C16 = CGA2B2C0G1H060D050BA: CAP CER 6PF 50V C0G 0402; Manufacturer: TDK Corporation; Unit Price (USD): 0.1; Tolerance: ±0.5pF; Temperature Coefficient: C0G, NP0; ComponentLink1URL: https://product.tdk.com/info/en/catalog/datasheets/mlcc_automotive_general_en.pdf?ref_disty=digikey; ComponentLink1Description: Series Datasheet; Supplier 1: Digikey; Supplier Part Number 1: 445-5579-1-ND; Series: CGA; Part Status: Active; Operating Temperature: -55°C ~ 125°C; Applications: AEC-Q200; Mounting Type: Surface Mount, MLCC; Package / Case: 0402 (1005 Metric); Size / Dimension: 0.039" L x 0.020" W (1.00mm x 0.50mm); Thickness (Max): 0.022" (0.55mm); Manufacturer Part Number: CGA2B2C0G1H060D050BA
D1 = LED_0603_WHITE_LTW-C193TS5: LED WHITE 0603 SMD; Manufacturer: Lite-On Inc; Supplier 1: Digikey; Manufacturer Part Number: LTW-C193TS5; ComponentLink1URL: http://optoelectronics.liteon.com/upload/download/DS22-2004-203/S_110_LTW-C193TS5.pdf; ComponentLink1Description: Datasheet; Supplier Part Number 1: 160-1721-1-ND; Supplier 2: LCSC; Supplier Part Number 2: C115462
D2 = LED_0603_BLUE_LTST-C191TBKT: LED 468NM BLUE CLEAR 0603 SMD; Manufacturer: Lite-On Inc; Supplier 1: Digikey; ComponentLink1URL: https://mm.digikey.com/Volume0/opasdata/d220001/medias/docus/1139/LTST-C190AKT.pdf; ComponentLink1Description: Datasheet; Supplier Part Number 1: 160-1647-1-ND; Manufacturer Part Number: LTST-C191TBKT; Supplier 2: LCSC; Supplier Part Number 2: C99290
D3 = LED_0603_GREEN_LTST-C190GKT: LED GREEN CLEAR 0603 SMD; Manufacturer: Lite-On Inc; Supplier 1: Digikey; ComponentLink1URL: https://mm.digikey.com/Volume0/opasdata/d220001/medias/docus/858/LTST-C190GKT.pdf; ComponentLink1Description: Datasheet; Supplier Part Number 1: 160-1183-1-ND; Manufacturer Part Number: LTST-C190GKT; Supplier 2: LCSC; Supplier Part Number 2: C125093
D4 = LED_0603_RED_LTST-C190KRKT: LED SUPER RED CLEAR 0603 SMD; Manufacturer 1: Lite-On Inc; Millicandela Rating: 54mcd; Current - Test: 20mA; Wavelength - Dominant: 631nm; Wavelength - Peak: 639nm; Viewing Angle: 130°; Voltage - Forward (Vf) (Typ): 2V; Lens Style/Size: Rectangle with Flat Top, 1.06mm x 0.8mm; Color: Red; Package / Case: 0603 (1608 Metric); Size / Dimension: 1.60mm L x 0.80mm W; Mounting Type: Surface Mount; ComponentLink1URL: http://optoelectronics.liteon.com/upload/download/DS-22-99-0151/S_110_LTST-C190KRKT.pdf; ComponentLink1Description: Datasheet; Supplier 1: Digikey; RoHS: RoHS Compliant; Category: Optoelectronics; Stock 1: 280448; Pricing 1: 1=0.28, 10=0.218, 100=0.1188, 250=0.0792, 500=0.06732, 1000=0.05148 (USD); Packaging: Cut Tape (CT); Lens Type: Clear; Height: 0.80mm; Luminous Flux @ Current - Test: -; Supplier Part Number 1: 160-1436-1-ND; Manufacturer Part Number 1: LTST-C190KRKT
FB1 = MPZ1005S221ET000: FERRITE BEAD 220 OHM 0402 1LN; Manufacturer: TDK Corporation; Filter Type: Power Line; Current Rating (Max): 900mA; DC Resistance (DCR) (Max): 220mOhm; ComponentLink1URL: https://product.tdk.com/info/en/catalog/datasheets/beads_commercial_power_mpz1005-e_en.pdf?ref_disty=digikey; ComponentLink1Description: Datasheet; Series: MPZ-E; Part Status: Active; Operating Temperature: -55°C ~ 125°C; Package / Case: 0402 (1005 Metric); Mounting Type: Surface Mount; Height (Max): 0.022" (0.55mm); Size / Dimension: 0.039" L x 0.020" W (1.00mm x 0.50mm); Supplier Part Number 1: 445-9329-1-ND; Supplier 1: Digikey; Manufacturer Part Number: MPZ1005S221ET000
J1 = CONN_SWD_CORTEX_DEBUG: CONN HEADER 10 POS DUAL .05" SMD; Manufacturer: Samtec Inc; Supplier 1: Digikey; ComponentLink1URL: http://www.samtec.com/documents/webfiles/cpdf/FTSH-1XX-XX-XXX-DV-XXX-MKT.pdf; ComponentLink1Description: Datasheet; Supplier Part Number 1: FTSH-105-01-L-DV-K-ND; Manufacturer Part Number: FTSH-105-01-L-DV-K; Supplier 2: LCSC; Supplier Part Number 2: C448647
R1-R3 R6 R8 R11 R13 R14 R16-R18 R20-R31 R33-R35 R37-R39 R41 = ERJ-2RKF33R0X: RES SMD 33 OHM 1% 1/10W 0402; Manufacturer: Panasonic Electronic Components; Unit Price (USD): 0.1; Power (Watts): 0.1W, 1/10W; Temperature Coefficient: ±100ppm/°C; ComponentLink1Description: Datasheet; ComponentLink1URL: https://industrial.panasonic.com/cdbs/www-data/pdf/RDA0000/AOA0000C304.pdf; Series: ERJ; Tolerance: ±1%; Composition: Thick Film; Features: Automotive AEC-Q200; Operating Temperature: -55°C ~ 155°C; Package / Case: 0402 (1005 Metric); Supplier Device Package: 0402; Size / Dimension: 0.039" L x 0.020" W (1.00mm x 0.50mm); Height - Seated (Max): 0.016" (0.40mm); Supplier 1: Digikey; Supplier Part Number 1: P33.0LCT-ND; Manufacturer Part Number: ERJ-2RKF33R0X
R4 R7 R9 R10 R15 R32 = ERJ-2RKF1001X: RES SMD 1K OHM 1% 1/10W 0402; Manufacturer 1: Panasonic Electronic Components; Unit Price (USD): 0.1; Power (Watts): 0.1W, 1/10W; Temperature Coefficient: ±100ppm/°C; ComponentLink1Description: Datasheet; ComponentLink1URL: https://industrial.panasonic.com/cdbs/www-data/pdf/RDA0000/AOA0000C304.pdf; Series: ERJ; Tolerance: ±1%; Composition: Thick Film; Features: Automotive AEC-Q200; Operating Temperature: -55°C ~ 155°C; Package / Case: 0402 (1005 Metric); Supplier Device Package: 0402; Size / Dimension: 0.039" L x 0.020" W (1.00mm x 0.50mm); Height - Seated (Max): 0.016" (0.40mm); Manufacturer Part Number 1: ERJ-2RKF1001X; Supplier 1: Digikey; Supplier Part Number 1: P1.00KLCT-ND
R5 = ERJ-2BQF1R0X: RES SMD 1 OHM 1% 1/6W 0402; Manufacturer: Panasonic Electronic Components; Unit Price (USD): 0.41; Power (Watts): 0.167W, 1/6W; Temperature Coefficient: ±250ppm/°C; ComponentLink1Description: Datasheet; ComponentLink1URL: https://industrial.panasonic.com/cdbs/www-data/pdf/RDN0000/AOA0000C313.pdf; Series: ERJ; Tolerance: ±1%; Composition: Thick Film; Features: Automotive AEC-Q200, Current Sense; Operating Temperature: -55°C ~ 125°C; Package / Case: 0402 (1005 Metric); Supplier Device Package: 0402; Size / Dimension: 0.039" L x 0.020" W (1.00mm x 0.50mm); Height - Seated (Max): 0.016" (0.40mm); Supplier 1: Digikey; Supplier Part Number 1: P17252CT-ND; Manufacturer Part Number: ERJ-2BQF1R0X
R12 = ERJ-8ENF1000V: RES SMD 100 OHM 1% 1/4W 1206; Manufacturer: Panasonic Electronic Components; Unit Price (USD): 0.1; Power (Watts): 0.25W, 1/4W; Temperature Coefficient: ±100ppm/°C; ComponentLink1Description: Datasheet; ComponentLink1URL: https://industrial.panasonic.com/cdbs/www-data/pdf/RDA0000/AOA0000C304.pdf; Series: ERJ; Tolerance: ±1%; Composition: Thick Film; Features: Automotive AEC-Q200; Operating Temperature: -55°C ~ 155°C; Package / Case: 1206 (3216 Metric); Supplier Device Package: 1206; Size / Dimension: 0.126" L x 0.063" W (3.20mm x 1.60mm); Height - Seated (Max): 0.028" (0.70mm); Supplier 1: Digikey; Supplier Part Number 1: P100FCT-ND; Manufacturer Part Number: ERJ-8ENF1000V
R19 = ERJ-2RKF1002X: RES SMD 10K OHM 1% 1/10W 0402; Manufacturer 1: Panasonic Electronic Components; Unit Price (USD): 0.1; Power (Watts): 0.1W, 1/10W; Temperature Coefficient: ±100ppm/°C; ComponentLink1Description: Datasheet; ComponentLink1URL: https://industrial.panasonic.com/cdbs/www-data/pdf/RDA0000/AOA0000C304.pdf; Series: ERJ; Tolerance: ±1%; Composition: Thick Film; Features: Automotive AEC-Q200; Operating Temperature: -55°C ~ 155°C; Package / Case: 0402 (1005 Metric); Supplier Device Package: 0402; Size / Dimension: 0.039" L x 0.020" W (1.00mm x 0.50mm); Height - Seated (Max): 0.016" (0.40mm); Manufacturer Part Number 1: ERJ-2RKF1002X; Supplier 1: Digikey; Supplier Part Number 1: P10.0KLCT-ND
R36 = ERJ-PA2F3300X: RES SMD 330 OHM 1% 1/5W 0402; Manufacturer: Panasonic Electronic Components; Unit Price (USD): 0.21; Power (Watts): 0.2W, 1/5W; Temperature Coefficient: ±100ppm/°C; ComponentLink1Description: Datasheet; ComponentLink1URL: https://industrial.panasonic.com/cdbs/www-data/pdf/RDO0000/AOA0000C331.pdf; Series: ERJ; Tolerance: ±1%; Composition: Thick Film; Features: Automotive AEC-Q200, Pulse Withstanding; Operating Temperature: -55°C ~ 155°C; Package / Case: 0402 (1005 Metric); Supplier Device Package: 0402; Size / Dimension: 0.039" L x 0.020" W (1.00mm x 0.50mm); Height - Seated (Max): 0.016" (0.40mm); Supplier 1: Digikey; Supplier Part Number 1: P17221CT-ND; Manufacturer Part Number: ERJ-PA2F3300X
R40 = ERJ-2RKF1501X: RES SMD 1.5K OHM 1% 1/10W 0402; Manufacturer: Panasonic Electronic Components; Unit Price (USD): 0.1; Power (Watts): 0.1W, 1/10W; Temperature Coefficient: ±100ppm/°C; ComponentLink1Description: Datasheet; ComponentLink1URL: https://industrial.panasonic.com/cdbs/www-data/pdf/RDA0000/AOA0000C304.pdf; Series: ERJ; Tolerance: ±1%; Composition: Thick Film; Features: Automotive AEC-Q200; Operating Temperature: -55°C ~ 155°C; Package / Case: 0402 (1005 Metric); Supplier Device Package: 0402; Size / Dimension: 0.039" L x 0.020" W (1.00mm x 0.50mm); Height - Seated (Max): 0.016" (0.40mm); Supplier 1: Digikey; Supplier Part Number 1: P1.50KLCT-ND; Manufacturer Part Number: ERJ-2RKF1501X
S1 = SWITCH_CHS-04TA: DIP Switch, Slide, SPST, Flush, Recessed, 6VDC, 100mA, CHS Series | Nidec Components CHS-04TA; Manufacturer: Nidec Copal; Supplier 1: Digikey; Supplier Part Number 1: 563-1007-1-ND; Manufacturer Part Number: CHS-04TA; Supplier 2: LCSC; Supplier Part Number 2: C2921610; ComponentLink1Description: Datasheet; ComponentLink1URL: https://www.nidec-components.com/e/catalog/switch/chs.pdf
S2 S3 = SWITCH_TS-1092S-B3D2-G: SWITCH TACTILE SPST-NO; Manufacturer: Yuandi; Supplier 1: LCSC; Supplier Part Number 1: C520860; Manufacturer Part Number: TS-1092S-B3D2-G; ComponentLink1Description: Datasheet; ComponentLink1URL: https://www.lcsc.com/datasheet/lcsc_datasheet_2005071437_Yuandi-TS-1092S-B3D2-G_C520860.pdf
TP1 TP2 = RH-5002: THT white clip turret; Manufacturer: ronghe; ComponentLink1Description: Datasheet; ComponentLink1URL: https://datasheet.lcsc.com/lcsc/2307040929_ronghe-RH-5000_C5277086.pdf; Supplier 1: LCSC; Supplier Part Number 1: C5199802; Manufacturer Part Number: RH-5002
U1 = MCU_STM32F427VGT6: ARM Cortex®-M4 STM32F4 Microcontroller IC 32-Bit 180MHz 1MB (1M x 8) FLASH 100-LQFP (14x14); Manufacturer: ST Microelectronics; Manufacturer Part Number: STM32F427VGT6; Supplier 1: Digikey; Supplier Part Number 1: 497-17449-ND; Supplier 2: LCSC; Supplier Part Number 2: C117815; ComponentLink1Description: Datasheet; ComponentLink1URL: https://www.st.com/content/ccc/resource/technical/document/datasheet/03/b4/b2/36/4c/72/49/29/DM00071990.pdf/files/DM00071990.pdf/jcr:content/translations/en.DM00071990.pdf; ComponentLink2Description: Reference Manual; ComponentLink2URL: https://www.st.com/resource/en/reference_manual/rm0090-stm32f405415-stm32f407417-stm32f427437-and-stm32f429439-advanced-armbased-32bit-mcus-stmicroelectronics.pdf; ComponentLink3Description: AN1709: Bootloader; ComponentLink3URL: https://www.st.com/resource/en/application_note/an2606-stm32-microcontroller-system-memory-boot-mode-stmicroelectronics.pdf
X1 = XTAL_XRCGB25M000F3A00R0: CRYSTAL 25.000MHZ 6PF SMD; Manufacturer: Murata; Supplier 1: Digikey; Supplier Part Number 1: 490-12146-2-ND; Manufacturer Part Number: XRCGB25M000F3A00R0; Supplier 2: LCSC; Supplier Part Number 2: C467842; ComponentLink1Description: Datasheet; ComponentLink1URL: https://www.murata.com/products/productdata/8801076543518/SPEC-XRCGB25M000F3A00R0.pdf

## Sheet conn_usbc.SchDoc
size A; SheetNumber: 12
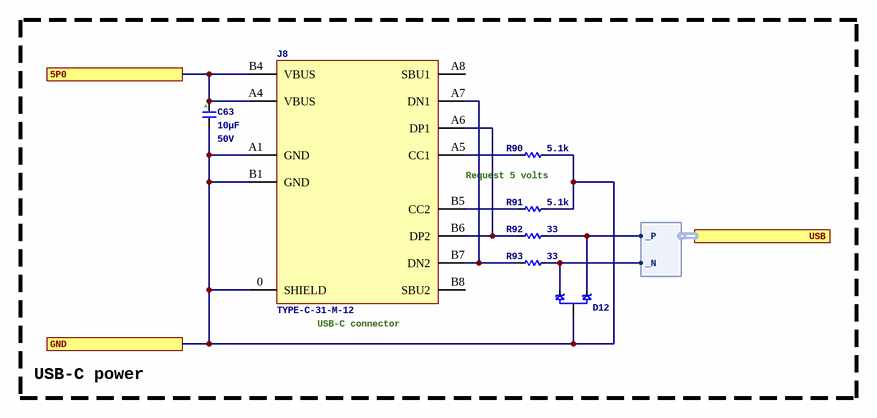
[diagram p5: conn_usbc.SchDoc]

### Parts
C63  Capacitance: 10µF  Voltage - Rated: 50V  [C1206_1.90MM]  (hidden comment: CGA5L1X7R1H106K160AC)
D12  PESD2USB3UX  [3SOT23]  (value not drawn)
J8  TYPE-C-31-M-12  [CONN_USBC_TYPE-C-31-M-12]
R90  Resistance: 5.1k  [R0402_0.40MM]  (hidden comment: ERJ-2RKF5101X)
R91  Resistance: 5.1k  [R0402_0.40MM]  (hidden comment: ERJ-2RKF5101X)
R92  Resistance: 33  [R0402_0.40MM]  (hidden comment: ERJ-2RKF33R0X)
R93  Resistance: 33  [R0402_0.40MM]  (hidden comment: ERJ-2RKF33R0X)

### Ports
5P0, GND, USB (harness DIFF)

### Harnesses
DIFF: _P, _N

### Nets
5P0: C63.1 J8.A4(VBUS) J8.B4(VBUS) ; port 5P0
GND: C63.2 D12.3 J8.0(SHIELD) J8.A1(GND) J8.B1(GND) R90.1 R91.1 ; port GND
USB._N: D12.2 R93.1 ; port USB._N
USB._P: D12.1 R92.1 ; port USB._P
NetJ8_A5: J8.A5(CC1) R90.2
NetJ8_A6: J8.A6(DP1) J8.B6(DP2) R92.2
NetJ8_A7: J8.A7(DN1) J8.B7(DN2) R93.2
NetJ8_B5: J8.B5(CC2) R91.2

Not connected (* = marked no-connect by the designer): J8 A8(SBU1) B8(SBU2)

### Notes on the sheet
- Request 5 volts
- (near J8) USB-C connector
- USB-C power
- (in symbol CGA5L1X7R1H106K160AC) A

### Library data of the parts
C63 = CGA5L1X7R1H106K160AC: CAP CER 10UF 50V X7R 1206; Manufacturer: TDK Corporation; Unit Price (USD): 1.03; Tolerance: ±10%; ComponentLink1URL: https://product.tdk.com/info/en/catalog/datasheets/mlcc_automotive_general_en.pdf?ref_disty=digikey; ComponentLink1Description: Series Datasheet; Series: CGA; Part Status: Active; Temperature Coefficient: X7R; Operating Temperature: -55°C ~ 125°C; Applications: AEC-Q200; Mounting Type: Surface Mount, MLCC; Package / Case: 1206 (3216 Metric); Size / Dimension: 0.126" L x 0.063" W (3.20mm x 1.60mm); Thickness (Max): 0.075" (1.90mm); Supplier 1: Digikey; Supplier Part Number 1: 445-180362-1-ND; Manufacturer Part Number: CGA5L1X7R1H106K160AC
D12 = TVS_PESD2USB3UX-T: DIODE ESD USB SOT-23; Manufacturer: Nexperia USA Inc.; Supplier 1: Digikey; Supplier Part Number 1: 1727-PESD2USB3UX-CT-ND; Manufacturer Part Number: PESD2USB3UX; Supplier 2: LCSC; Supplier Part Number 2: C3708426; ComponentLink1Description: Datasheet; ComponentLink1URL: https://assets.nexperia.com/documents/data-sheet/PESD2USB3UX-T.pdf
J8 = CONN_USBC_TYPE-C-31-M-12: 5A 1 16P Female Type-C SMD USB Connectors ROHS; Manufacturer: HRO Electronics; ComponentLink1Description: Product page; ComponentLink1URL: https://en.krhro.com/Product-Details/726.html; ComponentLink2Description: Drawing; ComponentLink2URL: https://omo-oss-file.thefastfile.com/portal-saas/new2023011311465142457/cms/file/95f41c83-14fa-41cb-9f86-8d6a717317e5.pdf; Supplier 1: LCSC; Supplier Part Number 1: C165948; Manufacturer Part Number: TYPE-C-31-M-12
R90 R91 = ERJ-2RKF5101X: RES SMD 5.1K OHM 1% 1/10W 0402; Manufacturer: Panasonic Electronic Components; Unit Price (USD): 0.1; Power (Watts): 0.1W, 1/10W; Temperature Coefficient: ±100ppm/°C; ComponentLink1Description: Datasheet; ComponentLink1URL: https://industrial.panasonic.com/cdbs/www-data/pdf/RDA0000/AOA0000C304.pdf; Series: ERJ; Tolerance: ±1%; Composition: Thick Film; Features: Automotive AEC-Q200; Operating Temperature: -55°C ~ 155°C; Package / Case: 0402 (1005 Metric); Supplier Device Package: 0402; Size / Dimension: 0.039" L x 0.020" W (1.00mm x 0.50mm); Height - Seated (Max): 0.016" (0.40mm); Supplier 1: Digikey; Supplier Part Number 1: P5.10KLCT-ND; Manufacturer Part Number: ERJ-2RKF5101X
R92 R93 = ERJ-2RKF33R0X: as R1 on sheet mcu_stm32f427; ComponentLink1Description: Datasheet; ComponentLink1URL: https://industrial.panasonic.com/cdbs/www-data/pdf/RDA0000/AOA0000C304.pdf; Series: ERJ; Tolerance: ±1%; Composition: Thick Film; Features: Automotive AEC-Q200; Operating Temperature: -55°C ~ 155°C; Package / Case: 0402 (1005 Metric); Supplier Device Package: 0402; Size / Dimension: 0.039" L x 0.020" W (1.00mm x 0.50mm); Height - Seated (Max): 0.016" (0.40mm); Supplier 1: Digikey; Supplier Part Number 1: P33.0LCT-ND; Manufacturer Part Number: ERJ-2RKF33R0X